# Altium schematic sheet 01_gihub_test.SchDoc: Block diagram
size A4; Organization: Lime Microsystems; Address1: Surrey Tech Centre; Address2: Guildford GU2 7YG; Address3: Surrey; Address4: United Kingdom; Revision: v1.1; SheetNumber: 1; SheetTotal: 12
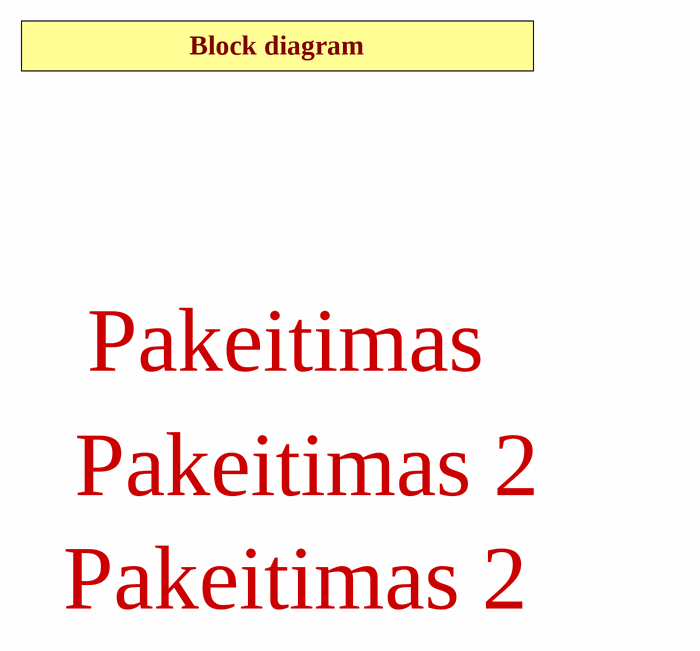
[diagram p0: 01_gihub_test.SchDoc]

## Notes on the sheet
- Block diagram
- Pakeitimas
- Pakeitimas 2
- Project name:
- Title:
- Size:
- Date:
- A4
- Revision:
- Time:
- Sheet
- of
- File: